# EAGLE design 8-10_step_sequencer (EAGLE 5.10)
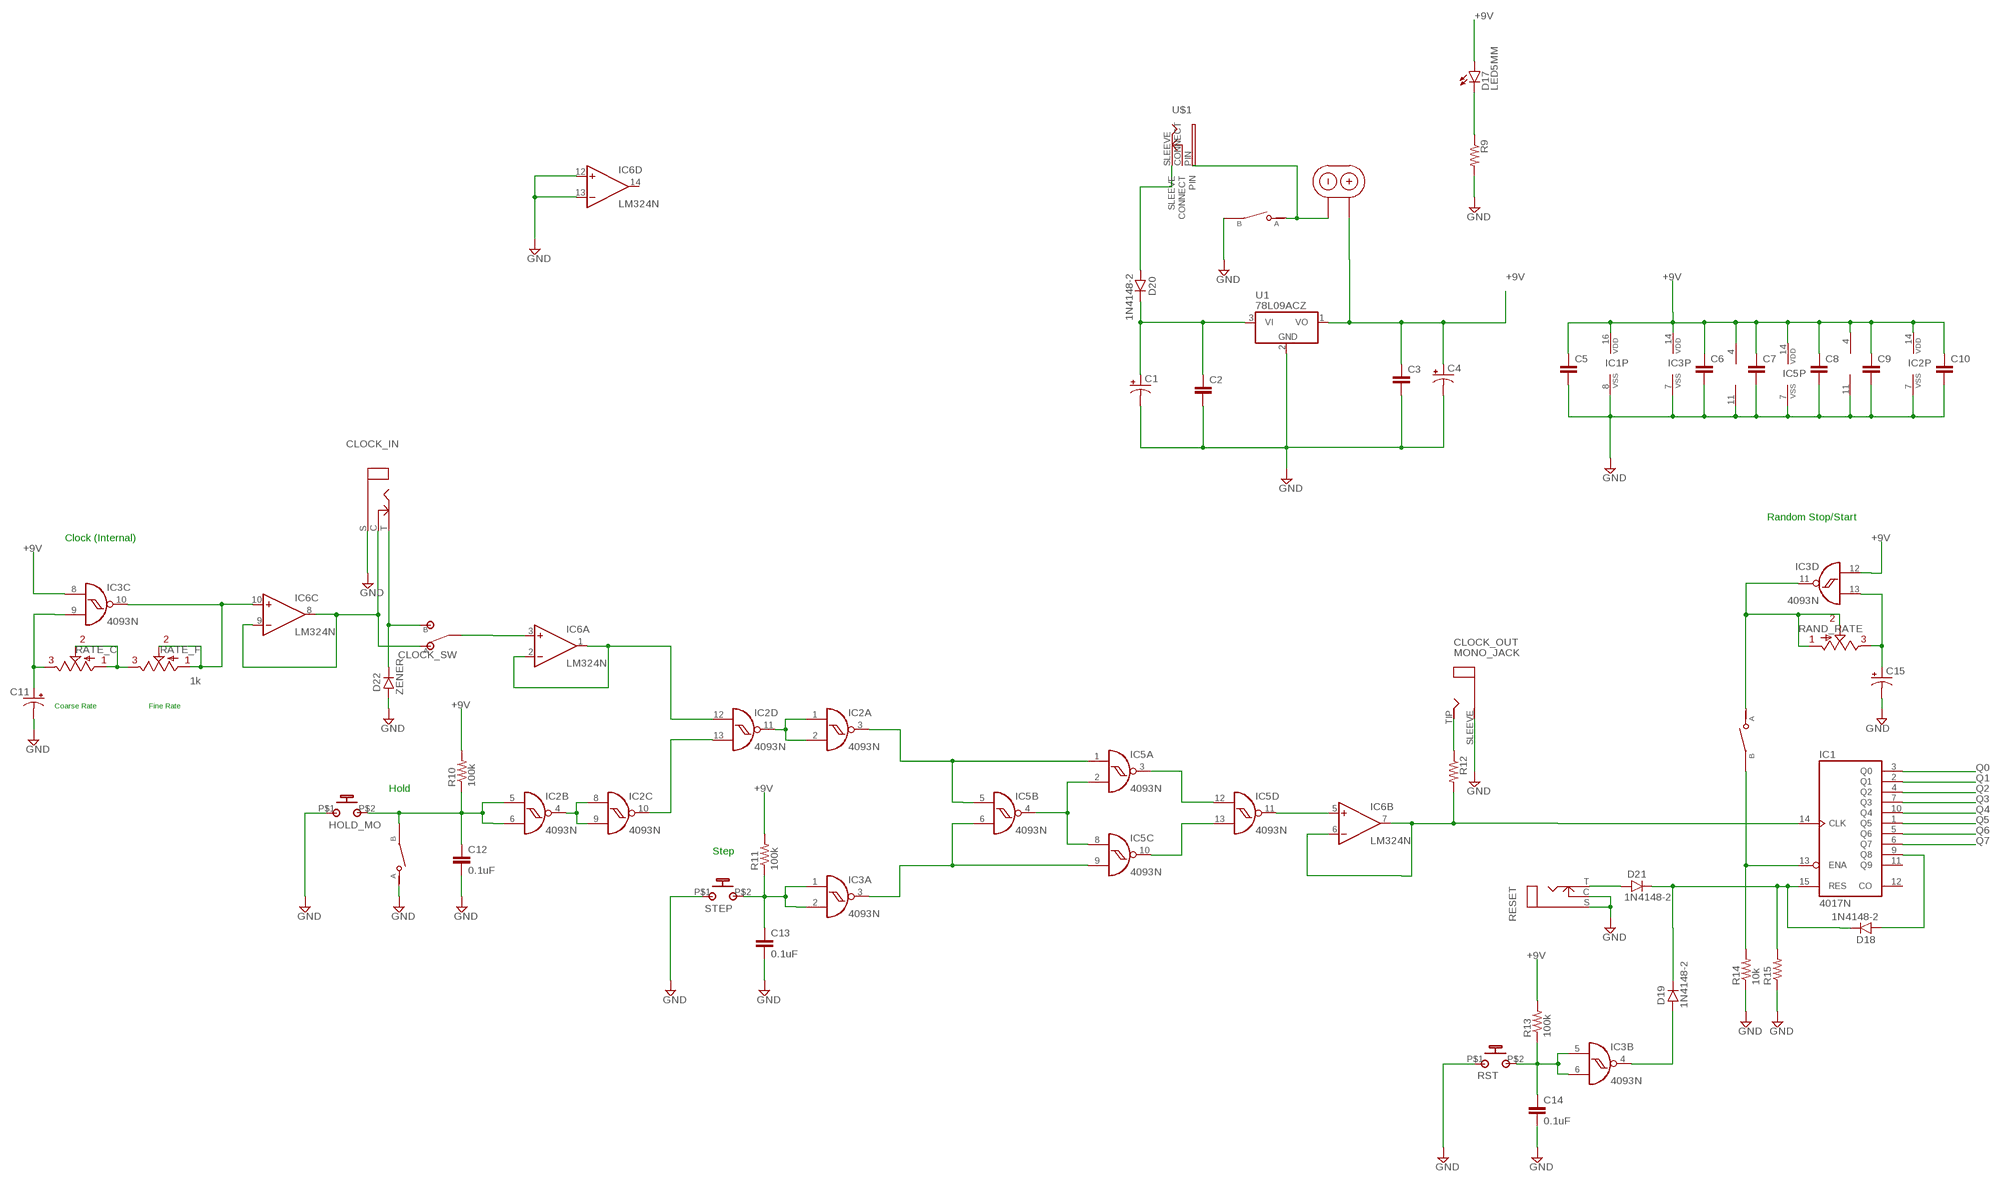
[diagram p0: schematic, sheet 1, part 1 of 2]
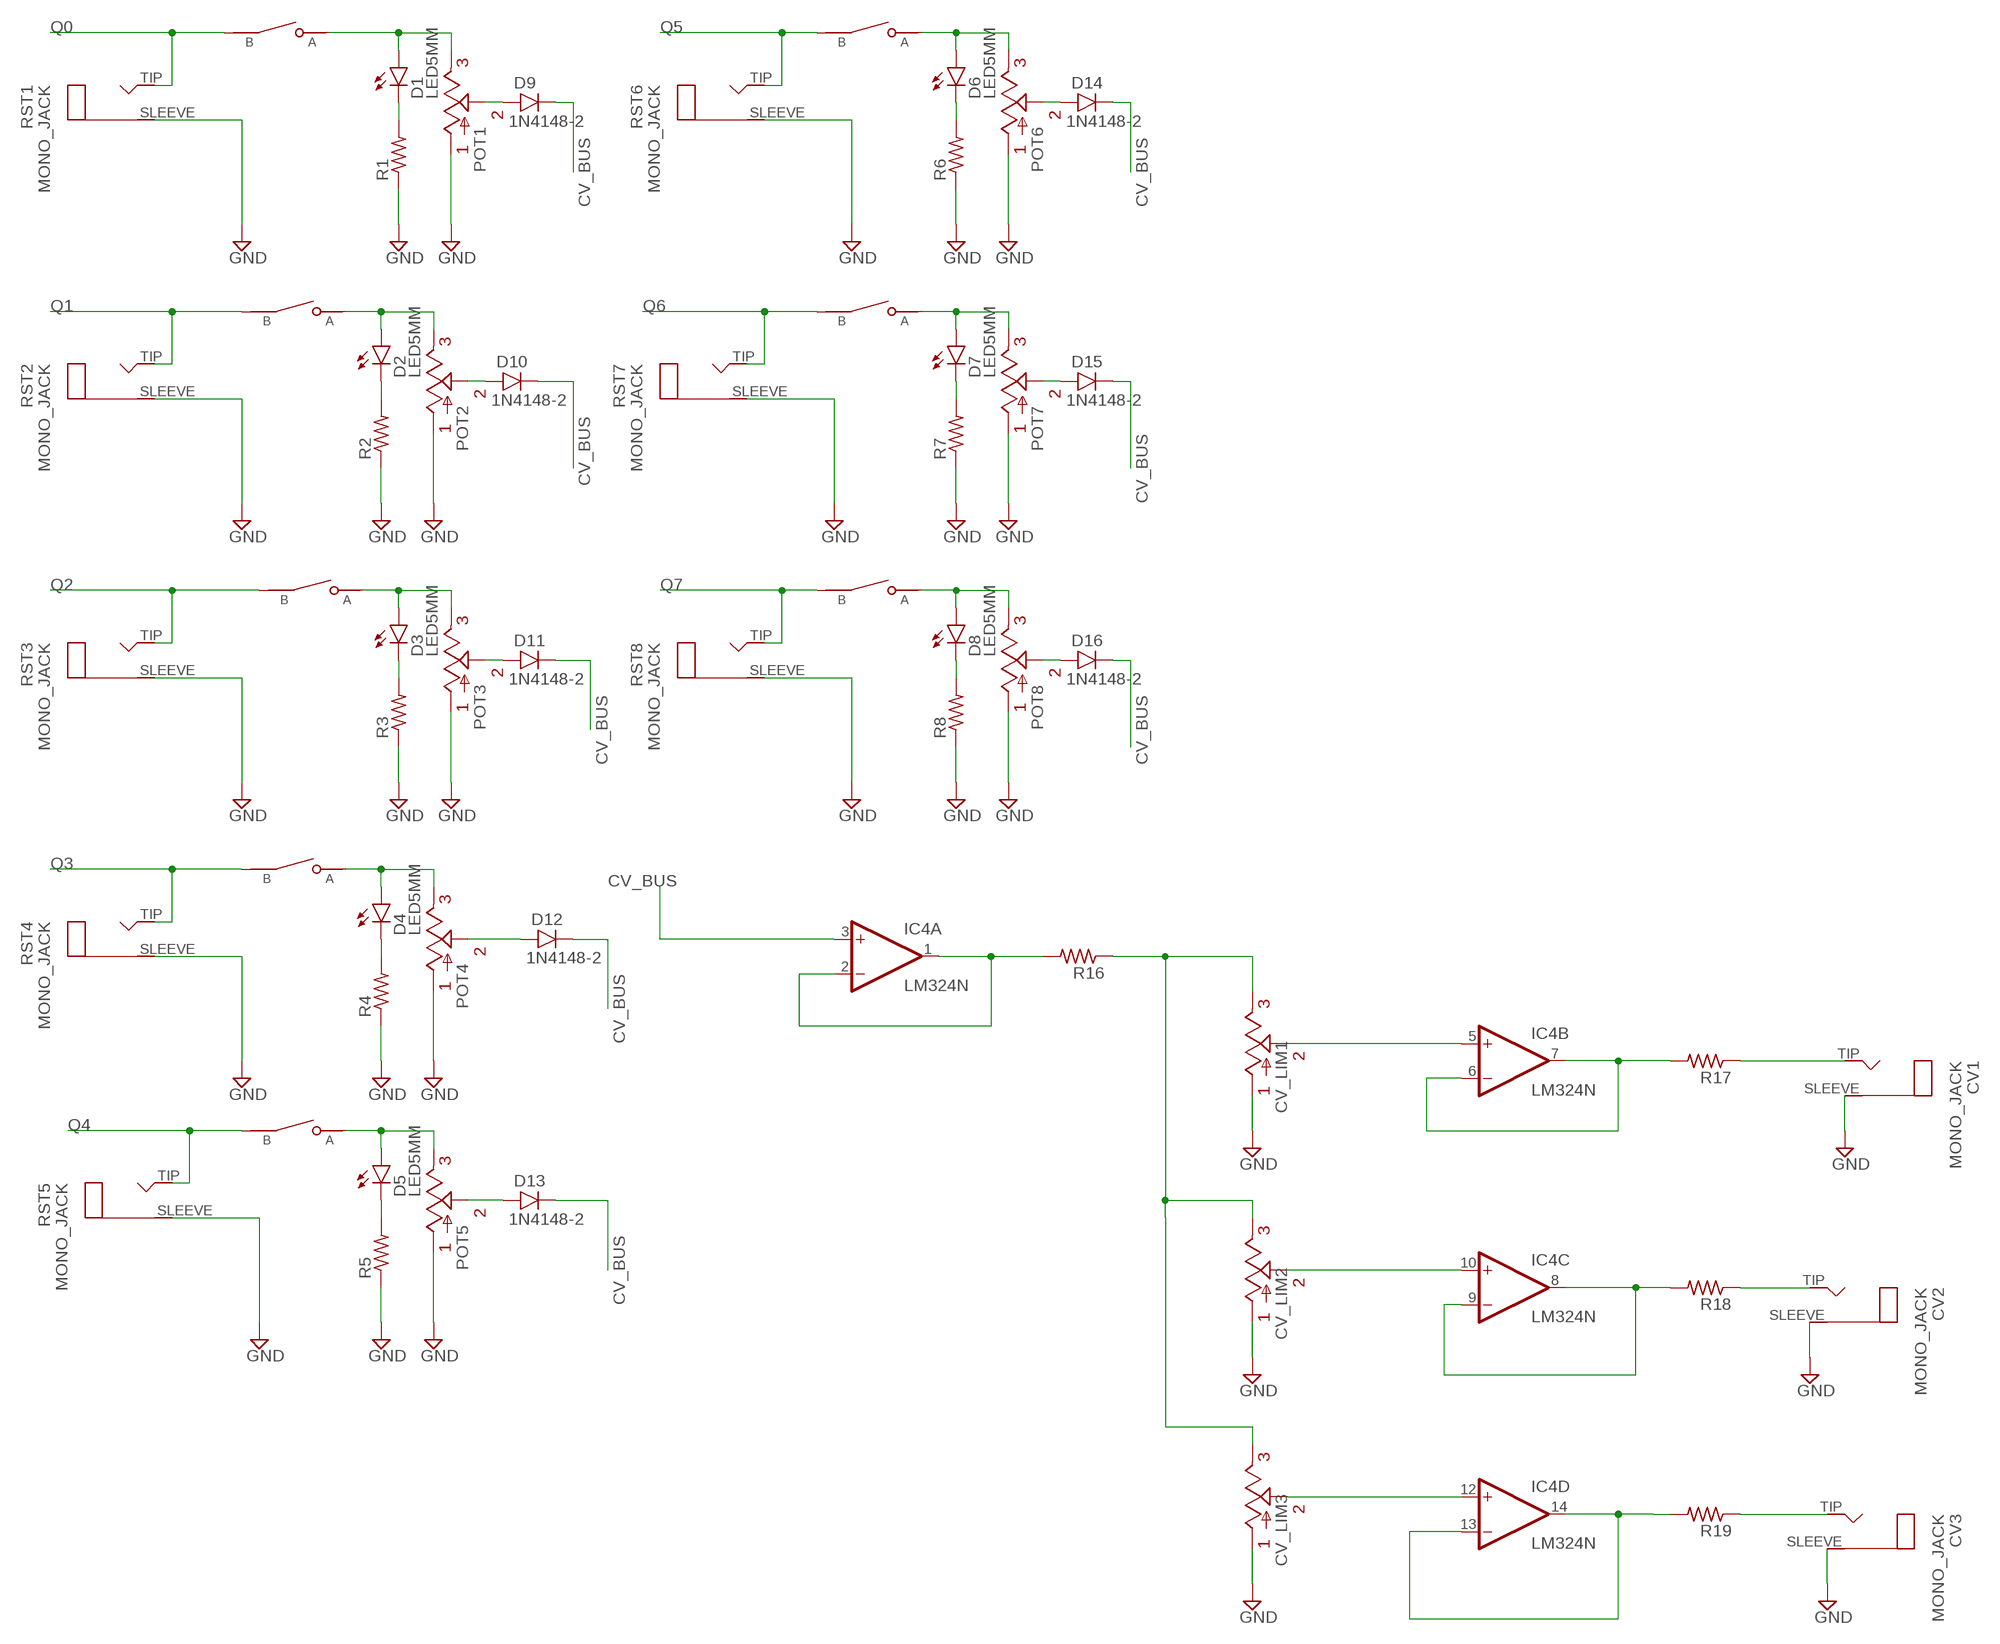
[diagram p1: schematic, sheet 1, part 2 of 2]

## Parts
C1  0631  [063_025]
C2  C5/3  [C5B3]
C3  C5/3  [C5B3]
C4  0631  [063_025]
C5  C5/3  [C5B3]
C6  C5/3  [C5B3]
C7  C5/3  [C5B3]
C8  C5/3  [C5B3]
C9  C5/3  [C5B3]
C10  C5/3  [C5B3]
C11  0631  [063_025]
C12  0.1uF  C5/3  [C5B3]
C13  0.1uF  C5/3  [C5B3]
C14  0.1uF  C5/3  [C5B3]
C15  0631  [063_025]
CLOCK_IN  MONO_JACK_W_SHUNT  [MONO_JACK_W_SHUNT]
CLOCK_OUT  MONO_JACK  [MONO_JACK]
CLOCK_SW  SPDT_SMALL  [SPDT_SMALL]
CV1  MONO_JACK  [MONO_JACK]
CV2  MONO_JACK  [MONO_JACK]
CV3  MONO_JACK  [MONO_JACK]
CV_LIM1  POT  [POT]
CV_LIM2  POT  [POT]
CV_LIM3  POT  [POT]
D1  LED5MM  [LED5MM]
D2  LED5MM  [LED5MM]
D3  LED5MM  [LED5MM]
D4  LED5MM  [LED5MM]
D5  LED5MM  [LED5MM]
D6  LED5MM  [LED5MM]
D7  LED5MM  [LED5MM]
D8  LED5MM  [LED5MM]
D9  1N4148-2  [DO35-2]
D10  1N4148-2  [DO35-2]
D11  1N4148-2  [DO35-2]
D12  1N4148-2  [DO35-2]
D13  1N4148-2  [DO35-2]
D14  1N4148-2  [DO35-2]
D15  1N4148-2  [DO35-2]
D16  1N4148-2  [DO35-2]
D17  LED5MM  [LED5MM]
D18  1N4148-2  [DO35-2]
D19  1N4148-2  [DO35-2]
D20  1N4148-2  [DO35-2]
D21  1N4148-2  [DO35-2]
D22  ZENER  1N4148-2  [DO35-2]
HOLD_HARD  SMALL_SPST_SWITCH  [SMALL_SPST]
HOLD_MO  MOMENTARY_SW_SMALL  [MOMENTARY_SW_SMALL]
IC1  4017N  [DIL16]
IC2  4093N  [DIL14]
IC3  4093N  [DIL14]
IC4  LM324N  [DIL14]
IC5  4093N  [DIL14]
IC6  LM324N  [DIL14]
ON-OFF  SMALL_SPST_SWITCH  [SMALL_SPST]
POT1  POT  [POT]
POT2  POT  [POT]
POT3  POT  [POT]
POT4  POT  [POT]
POT5  POT  [POT]
POT6  POT  [POT]
POT7  POT  [POT]
POT8  POT  [POT]
R1  RESISTOR  [RESISTOR]
R2  RESISTOR  [RESISTOR]
R3  RESISTOR  [RESISTOR]
R4  RESISTOR  [RESISTOR]
R5  RESISTOR  [RESISTOR]
R6  RESISTOR  [RESISTOR]
R7  RESISTOR  [RESISTOR]
R8  RESISTOR  [RESISTOR]
R9  RESISTOR  [RESISTOR]
R10  100k  RESISTOR  [RESISTOR]
R11  100k  RESISTOR  [RESISTOR]
R12  RESISTOR  [RESISTOR]
R13  100k  RESISTOR  [RESISTOR]
R14  10k  RESISTOR  [RESISTOR]
R15  RESISTOR  [RESISTOR]
R16  RESISTOR  [RESISTOR]
R17  RESISTOR  [RESISTOR]
R18  RESISTOR  [RESISTOR]
R19  RESISTOR  [RESISTOR]
RAND  SMALL_SPST_SWITCH  [SMALL_SPST]
RAND_RATE  POT  [POT]
RATE_C  POT  [POT]
RATE_F  1k  POT  [POT]
RESET  MONO_JACK_W_SHUNT  [MONO_JACK_W_SHUNT]
RST  MOMENTARY_SW_SMALL  [MOMENTARY_SW_SMALL]
RST1  MONO_JACK  [MONO_JACK]
RST2  MONO_JACK  [MONO_JACK]
RST3  MONO_JACK  [MONO_JACK]
RST4  MONO_JACK  [MONO_JACK]
RST5  MONO_JACK  [MONO_JACK]
RST6  MONO_JACK  [MONO_JACK]
RST7  MONO_JACK  [MONO_JACK]
RST8  MONO_JACK  [MONO_JACK]
STEP  MOMENTARY_SW_SMALL  [MOMENTARY_SW_SMALL]
SW1  SMALL_SPST_SWITCH  [SMALL_SPST]
SW2  SMALL_SPST_SWITCH  [SMALL_SPST]
SW3  SMALL_SPST_SWITCH  [SMALL_SPST]
SW4  SMALL_SPST_SWITCH  [SMALL_SPST]
SW5  SMALL_SPST_SWITCH  [SMALL_SPST]
SW6  SMALL_SPST_SWITCH  [SMALL_SPST]
SW7  SMALL_SPST_SWITCH  [SMALL_SPST]
SW8  SMALL_SPST_SWITCH  [SMALL_SPST]
U1  78L09ACZ  78L05ACZ  [TO-92]
U$1  DC_JACK_OFFBOARD  [DC_JACK_OFFBOARD]
U$2  9V_BATTERY_CLIP  [9V_BATTERY]

## Nets
+9V: C3.1 C4.+ C5.1 C6.1 C7.1 C8.1 C9.1 C10.1 D17.A IC1.16(VDD) IC2.14(P:VDD) IC3.8(C:I0) IC3.12(D:I0) IC3.14(P:VDD) IC4.4(P:V+) IC5.14(P:VDD) IC6.4(P:V+) R10.2 R11.2 R13.2 U1.1(VO) U$2.9V_BATTERY_+
CV_BUS: D9.C D10.C D11.C D12.C D13.C D14.C D15.C D16.C IC4.3(A:+IN)
GND: C1.- C2.2 C3.2 C4.- C5.2 C6.2 C7.2 C8.2 C9.2 C10.2 C11.- C12.2 C13.2 C14.2 C15.- CLOCK_IN.S(SLEEVE) CLOCK_OUT.SLEEVE CV1.SLEEVE CV2.SLEEVE CV3.SLEEVE CV_LIM1.1 CV_LIM2.1 CV_LIM3.1 D22.A HOLD_HARD.P$1(A) HOLD_MO.P$1(P) IC1.8(VSS) IC2.7(P:VSS) IC3.7(P:VSS) IC4.11(P:V-) IC5.7(P:VSS) IC6.11(P:V-) IC6.12(D:+IN) IC6.13(D:-IN) ON-OFF.P$2(B) POT1.1 POT2.1 POT3.1 POT4.1 POT5.1 POT6.1 POT7.1 POT8.1 R1.1 R2.1 R3.1 R4.1 R5.1 R6.1 R7.1 R8.1 R9.2 R14.1 R15.1 RESET.C(CONNECT) RESET.S(SLEEVE) RST1.SLEEVE RST2.SLEEVE RST3.SLEEVE RST4.SLEEVE RST5.SLEEVE RST6.SLEEVE RST7.SLEEVE RST8.SLEEVE RST.P$1(P) STEP.P$1(P) U1.2(GND)
N$1: C1.+ C2.1 D20.C U1.3(VI)
N$3: D18.C D19.C D21.C IC1.15(RES) R15.2
N$4: CLOCK_IN.C(CONNECT) CLOCK_SW.1(A) IC6.8(C:OUT) IC6.9(C:-IN)
N$5: C11.+ IC3.9(C:I1) RATE_C.3
N$6: C12.1 HOLD_HARD.P$2(B) HOLD_MO.P$2(S) IC2.5(B:I0) IC2.6(B:I1) R10.1
N$7: IC5.11(D:O) IC6.5(B:+IN)
N$8: IC3.11(D:O) RAND.P$1(A) RAND_RATE.1 RAND_RATE.2
N$9: C15.+ IC3.13(D:I1) RAND_RATE.3
N$10: IC1.13(ENA) R14.2 RAND.P$2(B)
N$11: D17.K(C) R9.1
N$12: ON-OFF.P$1(A) U$1.PIN U$2.9V_BATTERY_-
N$13: RATE_C.1 RATE_C.2 RATE_F.3
N$14: IC2.4(B:O) IC2.8(C:I0) IC2.9(C:I1)
N$15: IC1.14(CLK) IC6.6(B:-IN) IC6.7(B:OUT) R12.2
N$16: D20.A U$1.SLEEVE
N$17: IC3.10(C:O) IC6.10(C:+IN) RATE_F.1 RATE_F.2
N$18: C14.1 IC3.5(B:I0) IC3.6(B:I1) R13.1 RST.P$2(S)
N$19: D19.A IC3.4(B:O)
N$20: IC2.10(C:O) IC2.13(D:I1)
N$21: IC2.1(A:I0) IC2.2(A:I1) IC2.11(D:O)
N$22: IC5.2(A:I1) IC5.4(B:O) IC5.8(C:I0)
N$23: CV_LIM1.2 IC4.5(B:+IN)
N$24: IC5.10(C:O) IC5.13(D:I1)
N$25: D1.A POT1.3 SW1.P$1(A)
N$26: D1.K(C) R1.2
N$27: D9.A POT1.2
N$28: CV_LIM1.3 CV_LIM2.3 CV_LIM3.3 R16.1
N$29: D2.A POT2.3 SW2.P$1(A)
N$30: D2.K(C) R2.2
N$31: D10.A POT2.2
N$32: IC4.1(A:OUT) IC4.2(A:-IN) R16.2
N$33: D6.A POT6.3 SW6.P$1(A)
N$34: D6.K(C) R6.2
N$35: D14.A POT6.2
N$36: IC4.6(B:-IN) IC4.7(B:OUT) R17.2
N$37: D7.A POT7.3 SW7.P$1(A)
N$38: D7.K(C) R7.2
N$39: D15.A POT7.2
N$40: CV_LIM3.2 IC4.12(D:+IN)
N$41: D3.A POT3.3 SW3.P$1(A)
N$42: D3.K(C) R3.2
N$43: D11.A POT3.2
N$44: CV_LIM2.2 IC4.10(C:+IN)
N$45: D4.A POT4.3 SW4.P$1(A)
N$46: D4.K(C) R4.2
N$47: D12.A POT4.2
N$48: IC4.8(C:OUT) IC4.9(C:-IN) R18.2
N$49: D8.A POT8.3 SW8.P$1(A)
N$50: D8.K(C) R8.2
N$51: D16.A POT8.2
N$52: IC4.13(D:-IN) IC4.14(D:OUT) R19.2
N$53: IC5.3(A:O) IC5.12(D:I0)
N$54: IC3.3(A:O) IC5.6(B:I1) IC5.9(C:I1)
N$55: CLOCK_IN.T(TIP) CLOCK_SW.3(B) D22.C
N$56: CV3.TIP R19.1
N$57: D5.A POT5.3 SW5.P$1(A)
N$58: D5.K(C) R5.2
N$59: D13.A POT5.2
N$60: CV2.TIP R18.1
N$61: CV1.TIP R17.1
N$62: CLOCK_OUT.TIP R12.1
N$63: D18.A IC1.9(Q8)
N$64: CLOCK_SW.2(COM) IC6.3(A:+IN)
N$66: IC2.12(D:I0) IC6.1(A:OUT) IC6.2(A:-IN)
N$67: D21.A RESET.T(TIP)
N$69: IC2.3(A:O) IC5.1(A:I0) IC5.5(B:I0)
N$72: C13.1 IC3.1(A:I0) IC3.2(A:I1) R11.1 STEP.P$2(S)
Q0: IC1.3(Q0) RST1.TIP SW1.P$2(B)
Q1: IC1.2(Q1) RST2.TIP SW2.P$2(B)
Q2: IC1.4(Q2) RST3.TIP SW3.P$2(B)
Q3: IC1.7(Q3) RST4.TIP SW4.P$2(B)
Q4: IC1.10(Q4) RST5.TIP SW5.P$2(B)
Q5: IC1.1(Q5) RST6.TIP SW6.P$2(B)
Q6: IC1.5(Q6) RST7.TIP SW7.P$2(B)
Q7: IC1.6(Q7) RST8.TIP SW8.P$2(B)
Unconnected: IC1.11(Q9) IC1.12(CO) IC6.14(D:OUT) U$1.CONNECT

## Notes on the sheet
- Random Stop/Start
- Clock (Internal)
- Coarse Rate | Fine Rate
- Hold
- Step

## Library data of the parts
C1 C4 C11 C15 = gm-caps-electro-pol:063: 33 - 220uF Xicon values at Mouser.com 10V: 220uF; 16V: 100uF; 25V: 100uF; 50V: 33uF
C2 C3 C5-C10 C12-C14 = capacitor-wima:C: CAPACITOR naming: grid - package width
CLOCK_IN RESET = 00_steve:MONO_JACK_W_SHUNT
CLOCK_OUT CV1-CV3 RST1-RST8 = 00_steve:MONO_JACK
CLOCK_SW = 00_steve:SPDT_SMALL
CV_LIM1-CV_LIM3 POT1-POT8 RAND_RATE RATE_C RATE_F = 00_steve:POT
D1-D8 D17 = gm-diodes:LED
D9-D16 D18-D22 = gm-diodes:1N4148: Fast Switching Diode DO-35 glass case a.k.a. 1N914
HOLD_HARD ON-OFF RAND SW1-SW8 = 00_steve:SMALL_SPST_SWITCH
HOLD_MO RST STEP = 00_steve:MOMENTARY_SW_SMALL
IC1 = 40xx:4017: COUNTER/DIVIDER
IC2 IC3 IC5 = 40xx:4093: Quad 2-input NAND schmitt trigger
IC4 IC6 = linear:LM324: OP AMP
R1-R19 = 00_steve:RESISTOR
U1 = 00_steve:78L05ACZ
U$1 = 00_steve:DC_JACK_OFFBOARD
U$2 = 00_steve:9V_BATTERY_CLIP

## Board
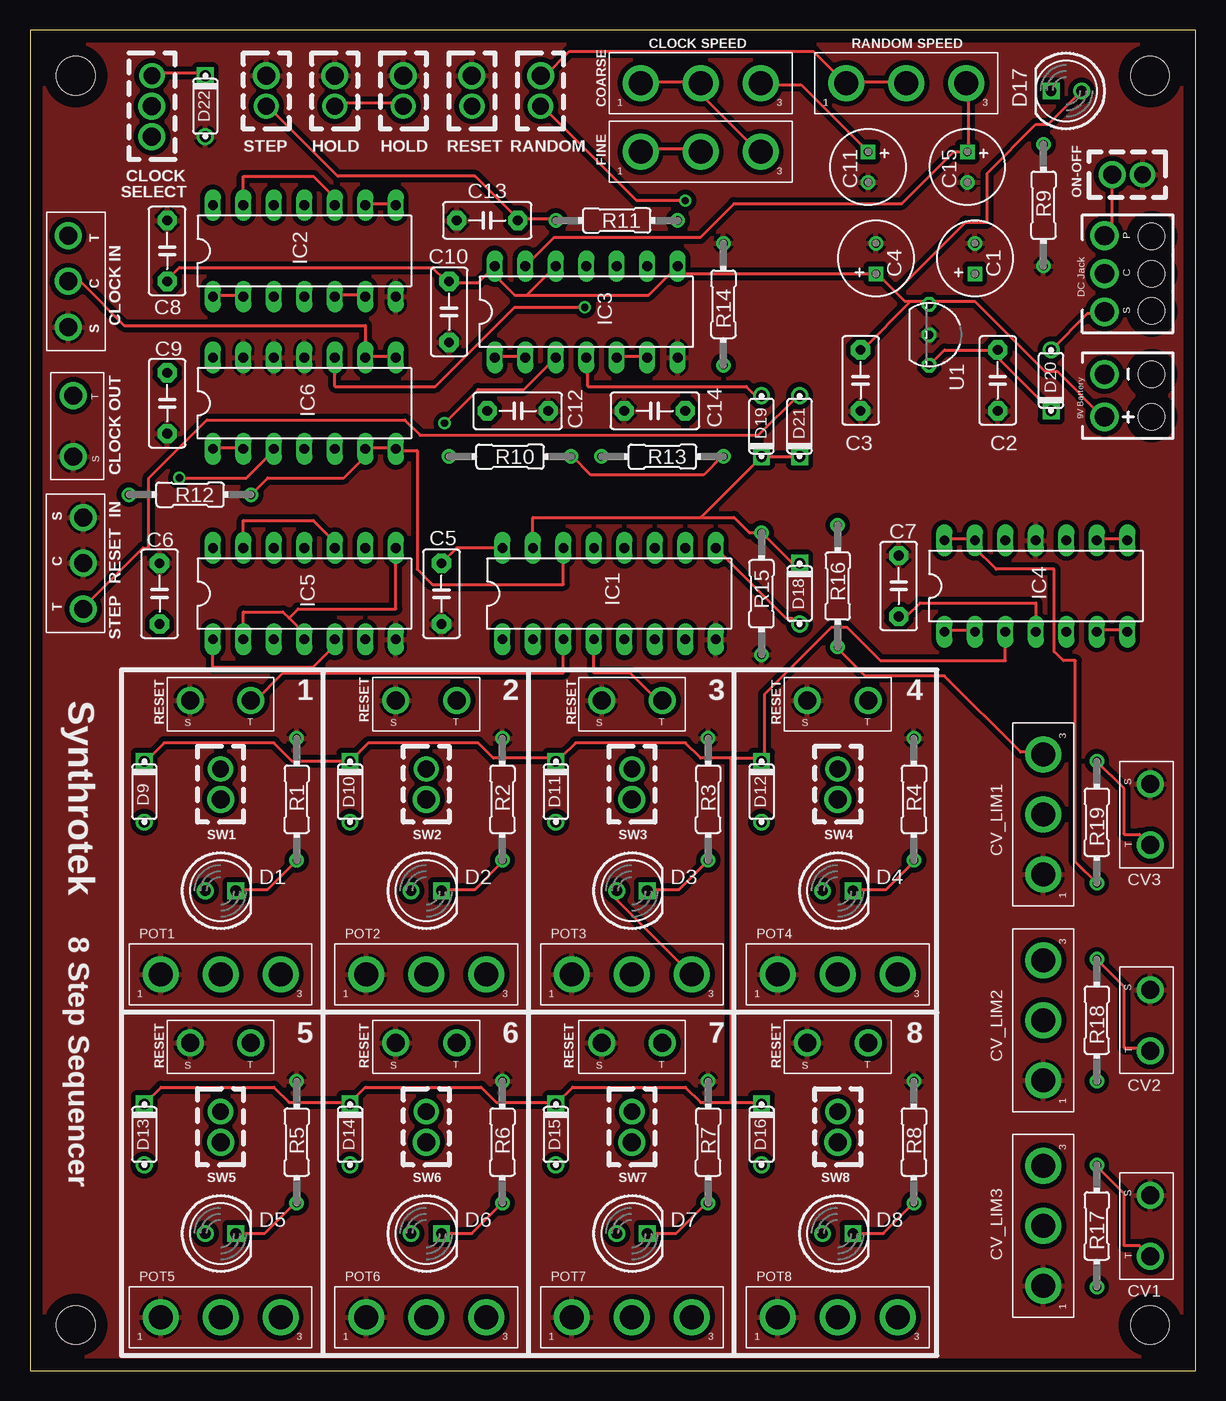
[diagram p2: board, top side]
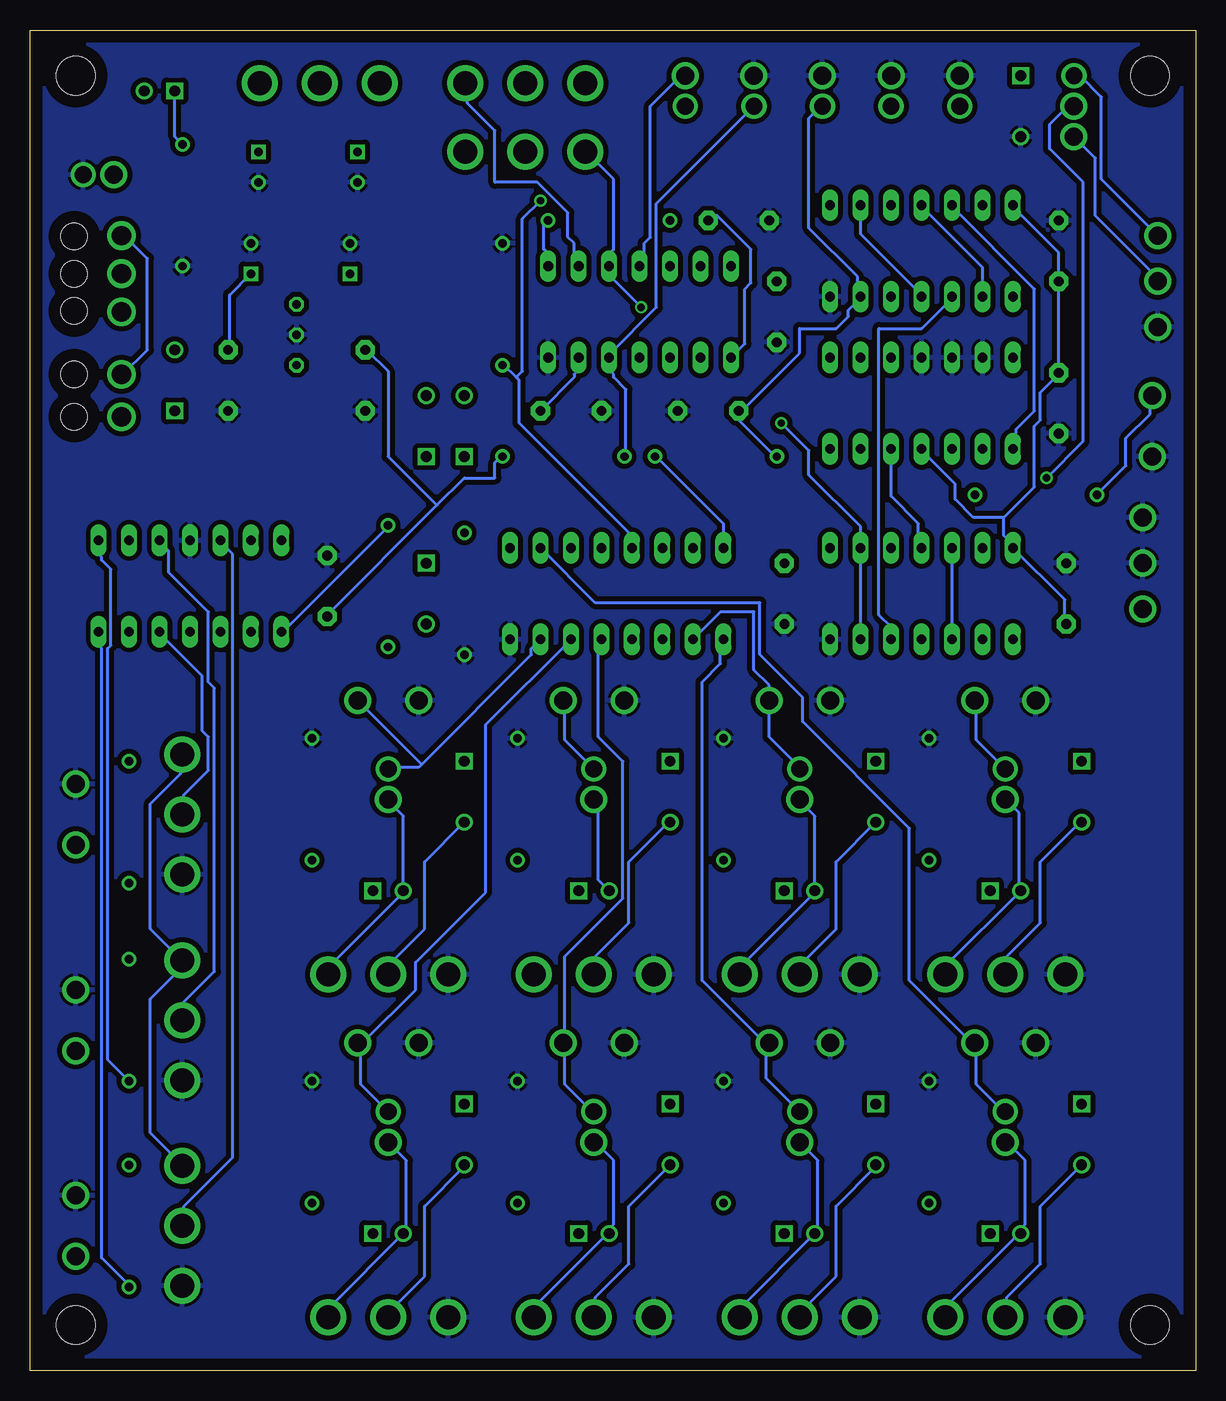
[diagram p3: board, bottom side, seen from below]

Size 97.16 x 111.76 mm. Coordinates in mm from the lower left corner, seen from the top.
Outline: 0,0 97.16,0 97.16,111.76 0,111.76 0,0
Copper layers (1*16): Top 0.035mm / dielectric 1.5mm / Bottom 0.035mm
Design rules "default": minimum track width 10mil, minimum drill 24mil, track to track 8mil, track to pad 8mil, pad to pad 8mil, via to via 8mil, smd to smd 8mil, copper to edge 40mil, drill to drill 8mil, minimum pad ring 10mil, minimum via ring 8mil, stop-mask expansion 4mil, vias tented up to drill 0mil, thermal gap 10mil
Holes 3.2 mm at 3.81,3.81 93.34,3.81 93.34,107.95 3.81,107.95

### Footprints (pad centres in the part's own frame; a part is rotated, then mirrored left to right if it is on the bottom)
063_025 = drill 0.7 square: + -1.27,0 | drill 0.7 round: - 1.27,0
C5B3 = drill 0.813 pad 1.6 octagon: 1 -2.54,0; 2 2.54,0
MONO_JACK_W_SHUNT = drill 1.5 round: C 0,0; S 3.81,0; T -3.81,0
MONO_JACK = drill 1.5 round: SLEEVE 2.54,0; TIP -2.54,0
SPDT_SMALL = drill 1.5 round: 1 -2.54,0; 2 0,0 | drill 1.4 round: 3 2.54,0
POT = drill 2 round: 1 -5,0; 2 0,0; 3 5,0
LED5MM = drill 0.9 round: A -1.27,0 | drill 0.9 square: K 1.27,0
DO35-2 = drill 0.9 round: A 2.54,0 | drill 0.9 square: C -2.54,0
SMALL_SPST = drill 1.5 round: P$1 -1.27,0 | drill 1.4 round: P$2 1.27,0
MOMENTARY_SW_SMALL = drill 1.5 round: P$1 -1.27,0 | drill 1.4 round: P$2 1.27,0
DIL16 = drill 0.813 long: 1 -8.89,-3.81; 2 -6.35,-3.81; 3 -3.81,-3.81; 4 -1.27,-3.81; 5 1.27,-3.81; 6 3.81,-3.81; 7 6.35,-3.81; 8 8.89,-3.81; 9 8.89,3.81; 10 6.35,3.81; 11 3.81,3.81; 12 1.27,3.81; 13 -1.27,3.81; 14 -3.81,3.81; 15 -6.35,3.81; 16 -8.89,3.81
DIL14 = drill 0.813 long: 1 -7.62,-3.81; 2 -5.08,-3.81; 3 -2.54,-3.81; 4 0,-3.81; 5 2.54,-3.81; 6 5.08,-3.81; 7 7.62,-3.81; 8 7.62,3.81; 9 5.08,3.81; 10 2.54,3.81; 11 0,3.81; 12 -2.54,3.81; 13 -5.08,3.81; 14 -7.62,3.81
RESISTOR = drill 0.7 round: 1 -5.08,0; 2 5.08,0
TO-92 = drill 0.7 octagon: 1 -2.54,0; 2 0,0; 3 2.54,0
DC_JACK_OFFBOARD = drill 1.6 round: CONNECT 0,1.27; PIN 3.175,1.27; SLEEVE -3.175,1.27 | hole 2.2: -3.111,-2.667; 0,-2.667; 3.111,-2.667
9V_BATTERY = drill 1.6 round: 9V_BATTERY_+ -1.778,1.27; 9V_BATTERY_- 1.778,1.27 | hole 2.2: -1.778,-2.667; 1.778,-2.667

### Placement (x,y rotation side)
C1  78.74,92.71 90 top
C2  80.64,82.55 270 top
C3  69.22,82.55 270 top
C4  70.48,92.71 90 top
C5  34.29,64.77 270 top
C6  10.79,64.77 90 top
C7  72.39,65.41 90 top
C8  11.43,93.34 90 top
C9  11.43,80.64 270 top
C10  34.92,88.27 270 top
C11  69.85,100.33 270 top
C12  40.64,80.01 0 top
C13  38.1,95.89 180 top
C14  52.07,80.01 180 top
C15  78.11,100.33 270 top
CLOCK_IN  3.17,90.81 270 top
CLOCK_OUT  3.62,78.74 270 top
CLOCK_SW  10.16,105.41 90 top
CV1  93.34,12.06 90 top
CV2  93.34,29.21 90 top
CV3  93.34,46.35 90 top
CV_LIM1  84.45,46.35 90 top
CV_LIM2  84.45,29.21 90 top
CV_LIM3  84.45,12.06 90 top
D1  15.88,40.01 0 top
D2  33.02,40.01 0 top
D3  50.16,40.01 0 top
D4  67.31,40.01 0 top
D5  15.88,11.43 0 top
D6  33.02,11.43 0 top
D7  50.16,11.43 0 top
D8  67.31,11.43 0 top
D9  9.53,48.26 270 top
D10  26.67,48.26 270 top
D11  43.81,48.26 270 top
D12  60.96,48.26 270 top
D13  9.53,19.68 270 top
D14  26.67,19.68 270 top
D15  43.81,19.68 270 top
D16  60.96,19.68 270 top
D17  86.36,106.68 180 top
D18  64.14,64.77 270 top
D19  60.96,78.74 90 top
D20  85.09,82.55 90 top
D21  64.14,78.74 90 top
D22  14.61,105.41 270 top
HOLD_HARD  31.11,106.68 270 top
HOLD_MO  25.4,106.68 270 top
IC1  48.26,64.77 0 top
IC2  22.86,93.34 0 top
IC3  46.35,88.27 0 top
IC4  83.82,65.41 0 top
IC5  22.86,64.77 0 top
IC6  22.86,80.64 0 top
ON-OFF  91.44,99.69 0 top
POT1  15.88,33.02 0 top
POT2  33.02,33.02 0 top
POT3  50.16,33.02 0 top
POT4  67.31,33.02 0 top
POT5  15.88,4.45 0 top
POT6  33.02,4.45 0 top
POT7  50.16,4.45 0 top
POT8  67.31,4.45 0 top
R1  22.23,47.62 270 top
R2  39.37,47.62 270 top
R3  56.52,47.62 270 top
R4  73.66,47.62 270 top
R5  22.23,19.05 270 top
R6  39.37,19.05 270 top
R7  56.52,19.05 270 top
R8  73.66,19.05 270 top
R9  84.45,97.16 270 top
R10  40.01,76.2 0 top
R11  48.9,95.89 0 top
R12  13.34,73.03 0 top
R13  52.7,76.2 0 top
R14  57.78,88.9 270 top
R15  60.96,64.77 90 top
R16  67.31,65.41 90 top
R17  88.9,12.06 270 top
R18  88.9,29.21 270 top
R19  88.9,45.72 270 top
RAND  42.55,106.68 270 top
RAND_RATE  73.03,107.31 0 top
RATE_C  55.88,107.31 0 top
RATE_F  55.88,101.6 0 top
RESET  4.45,67.31 90 top
RST  36.83,106.68 270 top
RST1  15.88,55.88 180 top
RST2  33.02,55.88 180 top
RST3  50.16,55.88 180 top
RST4  67.31,55.88 180 top
RST5  15.88,27.3 180 top
RST6  33.02,27.3 180 top
RST7  50.16,27.3 180 top
RST8  67.31,27.3 180 top
STEP  19.68,106.68 270 top
SW1  15.88,48.9 90 top
SW2  33.02,48.9 90 top
SW3  50.16,48.9 90 top
SW4  67.31,48.9 90 top
SW5  15.88,20.32 90 top
SW6  33.02,20.32 90 top
SW7  50.16,20.32 90 top
SW8  67.31,20.32 90 top
U1  74.93,86.36 270 top
U$1  90.81,91.44 90 top
U$2  90.81,81.28 90 top

### Tracks (layer width: path | path; a pad name or v marks a point on that pad's centre or on a via)
+9V
  Top 0.254: IC4.4 83.82,61.72 83.82,64.01 74.17,64.01 73.15,62.99 72.39,62.99 C7.1 | R13.2 57.66,76.2 56.13,74.68 46.74,74.68 45.21,76.2 R10.2 | C5.1 35.56,68.58 IC1.16 | 38.35,91.69 37.34,90.68 35.05,90.68 C10.1 34.8,90.93 34.54,90.93 33.53,91.95 12.45,91.95 11.43,90.93 C8.1 | 38.35,91.69 38.61,91.95 IC3.14 38.35,91.69 | 41.4,89.66 43.69,91.95 IC3.12 | 41.4,89.66 40.39,89.66 38.35,91.69 | 41.4,89.66 51.56,89.66 53.85,91.95 IC3.8 54.1,91.95 54.61,91.44 70.36,91.44 C4.+ 70.61,91.44 72.14,89.92 | 72.14,89.92 72.9,89.15 73.41,89.15 | 73.41,89.15 74.68,89.15 | 74.68,89.15 U1.1 74.68,89.15 | D17.A 84.84,103.89 83.82,103.89 79.76,99.82 79.76,95.76 77.98,95.76 72.14,89.92 | 73.41,89.15 69.34,85.09 C3.1 | 74.68,89.15 78.74,89.15 84.58,83.31 85.6,83.31 89.41,79.5 U$2.9V_BATTERY_+
  Bottom 0.254: IC1.16 39.37,70.61 44.96,76.2 R10.2 | 63.25,72.14 60.96,74.42 58.42,74.42 58.42,75.69 57.91,76.2 R13.2 | 63.25,72.14 72.39,62.99 C7.1 | IC2.14 15.24,97.03 11.43,93.22 11.43,90.93 C8.1 11.43,90.68 11.43,83.31 C9.1 11.43,83.06 12.95,81.53 12.95,79.25 13.46,78.74 13.46,73.66 16,71.12 | C6.1 10.92,62.23 10.92,64.26 IC5.14 15.24,68.83 16,69.6 16,71.12 | 16,71.12 18.54,71.12 20.07,72.64 20.07,73.91 22.86,76.71 IC6.4 | R11.2 54.1,95.76 54.36,95.5 54.36,93.47 54.1,93.22 54.1,92.2 IC3.8 | 63.25,72.14 67.31,76.2 67.31,83.31 69.09,85.09 C3.1
CV_BUS
  Top 0.254: 26.67,22.35 21.59,22.35 20.32,23.62 10.92,23.62 9.65,22.35 D13.C | 26.67,22.35 D14.C 26.67,22.35 | 58.42,22.35 60.96,22.35 D16.C | 58.42,22.35 55.88,22.35 54.61,23.62 45.21,23.62 43.94,22.35 D15.C 43.69,22.35 38.86,22.35 37.59,23.62 27.94,23.62 26.67,22.35 | D9.C 9.65,50.8 11.18,52.32 20.32,52.32 21.84,50.8 D10.C 28.19,52.32 37.34,52.32 38.61,51.05 44.2,51.05 | 61.21,51.05 61.21,50.8 D12.C 61.21,51.05 | 61.21,51.05 61.21,56.39 66.8,61.98 68.07,61.98 70.87,59.18 81.28,59.18 81.28,61.47 IC4.3 | 44.2,51.05 45.47,52.32 54.61,52.32 55.88,51.05 58.42,51.05 | 44.2,51.05 43.94,50.8 D11.C 44.2,51.05 | 58.42,51.05 61.21,51.05 | 58.42,22.35 58.42,51.05
GND
  pour Bottom (isolate 0.406): 0,111.76 97.16,111.76 97.16,0 0,0
  pour Top (isolate 0.406): 0,111.76 97.16,111.76 97.16,0 0,0
N$1
  Top 0.254: U1.3 76.2,85.09 80.01,85.09 | 80.01,85.09 80.52,85.09 C2.1 80.01,85.09 | 80.01,85.09 D20.C
  Bottom 0.254: C1.+ 80.52,89.66 80.52,85.09 C2.1
N$3
  Top 0.254: D21.C 64.01,76.2 D19.C 55.88,71.12 | D18.C 64.01,67.31 63.5,67.31 R15.2 59.94,69.85 58.67,71.12 55.88,71.12 | IC1.15 41.91,71.12 55.88,71.12
N$4
  Top 0.254: 27.94,84.58 30.48,84.58 IC6.8 | 27.94,84.58 IC6.9 27.94,84.58 | 27.94,84.58 27.94,87.12 7.87,87.12 4.32,90.68 3.3,90.68 CLOCK_IN.C
  Bottom 0.254: CLOCK_SW.1 8.38,101.09 8.38,96.27 3.3,91.19 3.3,90.93 CLOCK_IN.C
N$5
  Top 0.254: C11.+ 64.26,107.19 60.96,107.19 RATE_C.3
  Bottom 0.254: IC3.9 51.56,92.2 51.82,92.46 51.82,93.98 52.32,94.49 52.32,96.52 54.86,99.06 58.42,99.06 58.42,103.38 60.71,105.66 60.71,107.19 RATE_C.3
N$6
  Top 0.254: HOLD_MO.P$2 25.65,105.66 30.73,105.66 30.99,105.41 HOLD_HARD.P$2 | IC2.5 25.4,89.66 27.94,89.66 IC2.6
  Bottom 0.254: 38.1,79.76 C12.1 38.1,79.76 | 38.1,79.76 38.1,79.25 35.05,76.2 R10.1 | 28.19,89.15 28.96,88.39 28.96,87.88 29.97,86.87 33.02,86.87 33.02,84.84 38.1,79.76 | 28.19,89.15 27.94,89.41 IC2.6 28.19,89.15 | 28.19,89.15 28.19,91.19 32.26,95.25 32.26,104.39 31.24,105.41 HOLD_HARD.P$2
N$7
  Bottom 0.254: IC5.11 23.11,68.83 23.11,70.61 25.4,72.9 25.4,76.71 IC6.5
N$8
  Top 0.254: RAND_RATE.2 72.9,107.44 68.07,107.44 RAND_RATE.1 67.82,107.44 65.28,109.98 44.96,109.98 42.93,107.95 42.67,107.95 RAND.P$1
  Bottom 0.254: IC3.11 46.23,92.2 45.97,92.46 45.97,93.98 45.47,94.49 45.47,105.41 42.93,107.95 42.67,107.95 RAND.P$1
N$9
  Top 0.254: RAND_RATE.3 78.23,107.19 78.23,101.6 C15.+ 77.98,101.6 76.96,101.6 72.64,97.28 58.67,97.28 55.88,94.49 43.69,94.49 41.4,92.2 IC3.13
N$10  (via drill 0.61)
  Top 0.254: v54.61,97.54 50.55,97.54 42.67,105.41 RAND.P$2
  Bottom 0.254: 56.64,82.8 56.39,82.55 56.39,78.99 46.99,69.6 IC1.13 | 56.64,82.8 57.66,83.82 R14.2 | v54.61,97.54 56.13,96.01 56.13,83.31 56.64,82.8
N$11
  Bottom 0.254: D17.K 85.09,102.87 84.58,102.36 R9.1
N$12
  Top 0.254: ON-OFF.P$1 90.17,99.57 90.17,94.74 89.66,94.74 U$1.PIN
  Bottom 0.254: U$2.9V_BATTERY_- 89.41,83.06 87.38,85.09 87.38,92.71 89.41,94.74 U$1.PIN
N$13
  Top 0.254: 54.86,107.44 55.88,107.44 RATE_C.2 54.86,107.44 | 54.86,107.44 51.05,107.44 RATE_C.1 | 54.86,107.44 60.71,101.6 RATE_F.3
N$14
  Top 0.254: IC2.8 30.48,97.28 27.94,97.28 IC2.9
  Bottom 0.254: IC2.4 22.86,89.66 27.94,94.74 27.94,97.03 IC2.9
N$15
  Top 0.254: R12.2 18.54,73.15 19.81,74.42 26.16,74.42 27.94,76.2 27.94,76.71 IC6.6 27.94,76.96 30.48,76.96 IC6.7 30.48,76.71 32.26,76.71 32.26,66.8 33.53,65.53 44.45,65.53 IC1.14
N$16
  Top 0.254: D20.A 88.14,88.14 89.41,88.14 U$1.SLEEVE
N$17  (via drill 0.61)
  Top 0.254: RATE_F.2 55.63,101.85 51.31,101.85 51.05,101.6 RATE_F.1 | v46.23,88.65 40.39,88.65 33.78,82.04 25.4,82.04 25.4,84.33 IC6.10
  Bottom 0.254: v46.23,88.65 48.77,91.19 48.77,91.95 IC3.10 48.77,92.2 48.77,93.22 48.51,93.47 48.51,99.31 50.8,101.6 RATE_F.1
N$18
  Top 0.254: IC3.6 51.31,84.58 49.02,84.58 IC3.5
  Bottom 0.254: R13.1 47.5,76.2 47.5,81.79 48.51,82.8 48.51,83.06 48.77,83.31 48.77,84.33 IC3.5 48.77,84.58 48.77,84.84 44.96,88.65 44.96,97.28 RST.P$2 | C14.1 51.82,82.8 51.82,83.06 51.56,83.31 51.56,84.33 IC3.6
N$19
  Top 0.254: D19.A 60.45,81.28 59.69,82.04 46.48,82.04 46.48,84.33 IC3.4
N$20
  Top 0.254: IC2.13 17.78,97.28 17.78,99.57 23.62,99.57 25.4,97.79 25.4,97.28 IC2.10
N$21
  Top 0.254: IC2.1 15.24,89.66 17.78,89.66 IC2.2
  Bottom 0.254: IC2.11 22.86,97.03 17.78,91.95 17.78,89.66 IC2.2
N$22
  Top 0.254: IC5.2 17.78,63.25 21.08,63.25 21.59,62.74 | 21.59,62.74 22.86,61.47 IC5.4 | IC5.8 30.48,63.5 22.35,63.5 21.59,62.74
N$23
  Bottom 0.254: IC4.5 86.36,61.47 82.8,57.91 82.8,53.34 82.3,52.83 82.3,50.04 84.33,48.01 84.33,46.48 CV_LIM1.2
N$24
  Top 0.254: IC5.13 17.78,70.87 23.62,70.87 25.4,69.09 IC5.10
N$25
  Bottom 0.254: POT1.3 20.83,33.02 20.83,33.78 14.73,39.88 D1.A 14.73,40.13 14.73,46.48 15.75,47.5 SW1.P$1
N$26
  Top 0.254: R1.2 22.1,42.42 19.81,40.13 17.27,40.13 D1.K
N$27
  Bottom 0.254: D9.A 9.65,45.72 12.95,42.42 12.95,37.34 15.75,34.54 15.75,33.02 POT1.2
N$28
  Top 0.254: R16.1 67.31,60.2 69.6,57.91 76.2,57.91 82.55,51.56 84.33,51.56 CV_LIM1.3
  Bottom 0.254: CV_LIM3.3 84.58,17.27 87.12,19.81 87.12,30.99 84.58,33.53 84.58,34.04 CV_LIM2.3 84.58,34.29 87.12,36.83 87.12,47.24 84.58,49.78 84.58,51.31 CV_LIM1.3
N$29
  Bottom 0.254: POT2.3 37.85,33.02 37.85,33.78 31.75,39.88 D2.A 31.75,40.13 31.75,46.23 33.02,47.5 SW2.P$1
N$30
  Top 0.254: R2.2 39.37,42.42 37.08,40.13 34.29,40.13 D2.K
N$31
  Bottom 0.254: D10.A 29.97,42.42 29.97,36.83 33.02,33.78 POT2.2
N$32
  Top 0.254: IC4.2 78.74,61.72 76.2,61.72 IC4.1
  Bottom 0.254: R16.2 67.31,70.36 76.2,61.47 IC4.1
N$33
  Bottom 0.254: POT6.3 37.85,4.57 37.85,5.33 D6.A 31.5,11.68 31.5,17.53 SW6.P$1
N$34
  Top 0.254: R6.2 36.83,11.43 D6.K
N$35
  Bottom 0.254: D14.A 26.67,17.02 29.97,13.72 29.97,7.87 33.02,4.83 33.02,4.57 POT6.2
N$36
  Top 0.254: IC4.6 88.9,61.72 91.44,61.72 IC4.7
  Bottom 0.254: R17.2 88.9,7.11 91.19,9.4 91.19,60.2 91.44,60.45 91.44,61.47 IC4.7
N$37
  Bottom 0.254: POT7.3 55.12,4.57 55.12,5.33 49.02,11.43 D7.A 48.77,11.43 48.77,11.94 48.51,12.19 48.51,17.53 50.04,19.05 SW7.P$1
N$38
  Top 0.254: R7.2 56.39,13.97 53.85,11.43 51.56,11.43 D7.K
N$39
  Bottom 0.254: D15.A 43.94,17.02 47.24,13.72 47.24,8.89 50.04,6.1 50.04,4.57 POT7.2
N$40
  Bottom 0.254: IC4.12 81.28,69.09 80.26,68.07 80.26,17.78 84.33,13.72 84.33,12.19 CV_LIM3.2
N$41
  Top 0.254: POT3.3 55.12,33.02 48.77,39.37 48.77,39.88 D3.A
  Bottom 0.254: D3.A 49.02,40.13 49.78,40.89 49.78,47.24 50.04,47.5 SW3.P$1
N$42
  Top 0.254: R3.2 56.39,42.42 54.1,40.13 51.56,40.13 D3.K
N$43
  Bottom 0.254: D11.A 43.94,45.72 47.24,42.42 47.24,37.34 50.04,34.54 50.04,33.02 POT3.2
N$44
  Bottom 0.254: IC4.10 86.36,69.09 85.6,68.33 85.6,66.55 82.3,63.25 82.3,57.4 81.79,56.9 81.79,33.27 84.33,30.73 84.33,29.21 CV_LIM2.2
N$45
  Bottom 0.254: POT4.3 72.14,33.02 72.14,33.78 66.04,39.88 D4.A 66.04,40.13 66.04,46.23 67.31,47.5 SW4.P$1
N$46
  Top 0.254: R4.2 73.66,42.42 71.37,40.13 68.58,40.13 D4.K
N$47
  Bottom 0.254: D12.A 64.26,42.42 64.26,36.83 67.31,33.78 POT4.2
N$48
  Top 0.254: IC4.9 88.9,69.34 91.44,69.34 IC4.8
  Bottom 0.254: R18.2 90.68,25.91 90.68,60.2 90.42,60.45 90.42,66.8 91.19,67.56 91.19,67.82 91.44,68.07 91.44,69.09 IC4.8
N$49
  Bottom 0.254: POT8.3 72.14,4.57 72.14,5.33 D8.A 65.79,11.68 65.79,17.53 SW8.P$1
N$50
  Top 0.254: R8.2 71.12,11.43 D8.K
N$51
  Bottom 0.254: D16.A 60.96,17.02 64.26,13.72 64.26,7.87 67.31,4.83 67.31,4.57 POT8.2
N$52
  Top 0.254: R19.2 87.12,42.42 87.12,59.18 86.11,59.18 85.34,59.94 85.34,66.8 80.52,66.8 78.74,68.58 78.74,69.09 IC4.13 78.74,69.34 76.2,69.34 IC4.14
N$53
  Bottom 0.254: IC5.3 IC5.12
N$54  (via drill 0.61)
  Top 0.254: v34.54,78.99 37.34,81.79 41.15,81.79 43.69,84.33 IC3.3
  Bottom 0.254: IC5.6 IC5.9 27.94,70.36 32.26,74.68 32.26,76.71 v34.54,78.99
N$55
  Top 0.254: CLOCK_SW.3 10.41,108.2 14.22,108.2 14.48,107.95 D22.C
  Bottom 0.254: CLOCK_SW.3 9.65,107.95 7.87,106.17 7.87,99.31 3.3,94.74 CLOCK_IN.T
N$56
  Top 0.254: R19.1 91.19,48.51 91.19,44.7 92.46,44.7 93.22,43.94 CV3.TIP
N$57
  Bottom 0.254: POT5.3 20.83,4.57 20.83,5.33 14.73,11.43 D5.A 14.48,11.43 14.48,11.94 14.22,12.19 14.22,17.53 15.75,19.05 SW5.P$1
N$58
  Top 0.254: R5.2 22.1,13.97 19.56,11.43 17.27,11.43 D5.K
N$59
  Bottom 0.254: D13.A 9.65,17.02 12.95,13.72 12.95,8.89 15.75,6.1 15.75,4.57 POT5.2
N$60
  Top 0.254: R18.1 91.19,32 91.19,26.92 92.96,26.92 93.22,26.67 CV2.TIP
N$61
  Top 0.254: R17.1 88.9,17.02 91.19,14.73 91.19,10.41 92.46,10.41 93.22,9.65 CV1.TIP
N$62
  Bottom 0.254: R12.1 8.13,73.15 5.84,75.44 5.84,77.72 3.81,79.76 3.81,81.28 CLOCK_OUT.TIP
N$63
  Top 0.254: IC1.9 62.99,62.74 63.5,62.74 64.01,62.23 D18.A
N$64  (via drill 0.61)
  Top 0.254: v12.45,74.42 18.03,74.42 20.32,76.71 IC6.3
  Bottom 0.254: v12.45,74.42 9.4,77.47 9.4,99.06 12.19,101.85 12.19,103.89 10.67,105.41 CLOCK_SW.2
N$66
  Top 0.254: IC6.1 15.24,76.96 17.78,76.96 IC6.2
  Bottom 0.254: IC2.12 20.32,97.03 13.46,90.17 13.46,80.01 14.99,78.49 14.99,78.23 15.24,77.98 15.24,76.96 IC6.1
N$67
  Top 0.254: D21.A 64.01,81.28 60.71,77.98 32.51,77.98 31.24,79.25 14.73,79.25 9.91,74.42 9.91,68.58 9.4,68.58 4.32,63.5 RESET.T
N$69
  Top 0.254: IC5.1 15.24,58.67 23.62,58.67 25.4,60.45 IC5.5
  Bottom 0.254: IC5.5 25.4,61.98 26.42,62.99 26.42,86.87 22.86,86.87 20.32,89.41 IC2.3
N$72
  Top 0.254: IC3.1 38.86,84.58 41.15,84.58 IC3.2 | 40.64,96.01 43.69,96.01 R11.1 | 40.64,96.01 C13.1 40.64,96.01 | 40.64,96.01 37.08,99.57 25.65,99.57 19.81,105.41 STEP.P$2
  Bottom 0.254: IC3.1 38.61,84.58 37.59,85.6 37.59,90.17 37.08,90.68 37.08,93.47 39.88,96.27 40.64,96.27 40.64,96.01 C13.1
Q0
  Top 0.254: IC1.3 44.45,58.17 21.08,58.17 18.8,55.88 18.54,55.88 RST1.TIP
  Bottom 0.254: SW1.P$2 16,50.29 18.29,52.58 18.29,55.88 RST1.TIP
Q1
  Bottom 0.254: IC1.2 39.62,63.25 36.83,63.25 36.83,58.42 35.56,57.15 RST2.TIP 35.56,52.83 33.02,50.29 SW2.P$2
Q2
  Top 0.254: IC1.4 46.99,58.17 50.04,58.17 52.32,55.88 52.58,55.88 RST3.TIP
  Bottom 0.254: SW3.P$2 50.29,50.29 52.58,52.58 52.58,55.88 RST3.TIP
Q3
  Bottom 0.254: IC1.7 55.37,60.2 55.37,59.69 64.52,50.55 | 64.52,50.55 64.77,50.29 67.31,50.29 SW4.P$2 | 64.52,50.55 RST4.TIP
Q4
  Bottom 0.254: IC1.10 50.04,64.01 36.32,64.01 36.32,59.69 32.77,56.13 32.77,54.1 23.88,45.21 23.88,32.51 18.54,27.18 RST5.TIP 18.29,27.18 18.29,23.88 16,21.59 SW5.P$2
Q5
  Bottom 0.254: IC1.1 39.62,60.71 39.62,58.93 41.15,57.4 41.15,32.51 36.07,27.43 35.81,27.43 | 35.81,27.43 35.56,27.43 RST6.TIP 35.81,27.43 | SW6.P$2 35.81,24.38 35.81,27.43
Q6
  Bottom 0.254: IC1.5 49.78,60.71 49.78,52.83 47.75,50.8 47.75,39.37 52.58,34.54 52.58,27.43 RST7.TIP 52.58,27.18 52.58,23.88 50.29,21.59 SW7.P$2
Q7
  Bottom 0.254: IC1.6 59.18,53.85 59.18,39.88 65.02,34.04 65.02,31.75 69.34,27.43 69.6,27.43 | 69.6,27.43 69.85,27.43 RST8.TIP 69.6,27.43 | SW8.P$2 69.6,23.88 69.6,27.43

### Text on the board
tPlace: CLOCK SPEED | RANDOM SPEED | COARSE | STEP | HOLD | HOLD | RESET | RANDOM | FINE | CLOCK | SELECT | IN | CLOCK | CLOCK OUT | IN | RESET | STEP | Synthrotek | 1 | 2 | 3 | 4 | RESET | RESET | RESET | RESET | 8 Step Sequencer | 5 | 6 | 7 | 8 | RESET | RESET | RESET | RESET